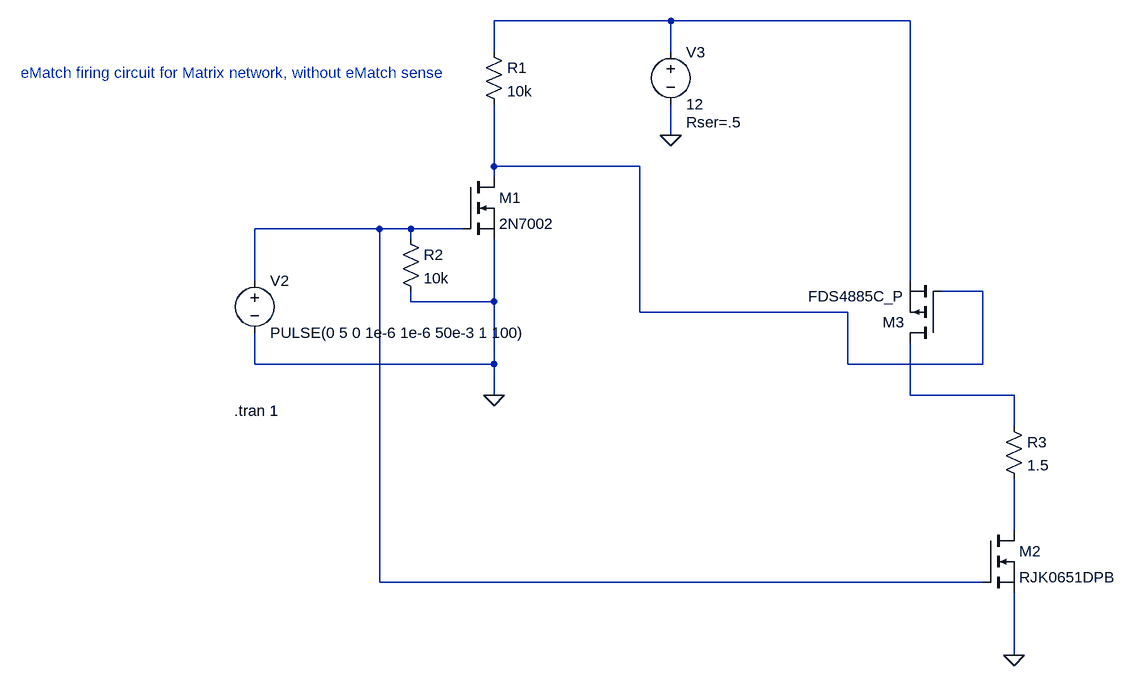
[diagram p0: schematic MatrixFire.asc]
MatrixFire.asc, the LTspice schematic file:
Version 4
SHEET 1 1420 900
WIRE 432 -96 160 -96
WIRE 800 -96 432 -96
WIRE 160 -48 160 -96
WIRE 432 -48 432 -96
WIRE 432 80 432 32
WIRE 160 128 160 32
WIRE 384 128 160 128
WIRE 160 144 160 128
WIRE -16 224 -208 224
WIRE 32 224 -16 224
WIRE 112 224 32 224
WIRE 32 240 32 224
WIRE -208 304 -208 224
WIRE 800 304 800 -96
WIRE 912 320 848 320
WIRE 32 336 32 320
WIRE 160 336 160 240
WIRE 160 336 32 336
WIRE 384 352 384 128
WIRE 704 352 384 352
WIRE -208 432 -208 384
WIRE 160 432 160 336
WIRE 160 432 -208 432
WIRE 704 432 704 352
WIRE 912 432 912 320
WIRE 912 432 704 432
WIRE 160 480 160 432
WIRE 800 480 800 400
WIRE 960 480 800 480
WIRE 960 528 960 480
WIRE 960 688 960 608
WIRE -16 768 -16 224
WIRE 912 768 -16 768
WIRE 960 880 960 784
FLAG 160 480 0
FLAG 432 80 0
FLAG 960 880 0
SYMBOL nmos 112 144 R0
SYMATTR InstName M1
SYMATTR Value 2N7002
SYMBOL res 144 -64 R0
SYMATTR InstName R1
SYMATTR Value 10k
SYMBOL res 16 224 R0
SYMATTR InstName R2
SYMATTR Value 10k
SYMBOL voltage -208 288 R0
WINDOW 123 0 0 Left 2
WINDOW 39 0 0 Left 2
SYMATTR InstName V2
SYMATTR Value PULSE(0 5 0 1e-6 1e-6 50e-3 1 100)
SYMBOL voltage 432 -64 R0
WINDOW 123 0 0 Left 2
WINDOW 39 24 124 Left 2
SYMATTR SpiceLine Rser=.5
SYMATTR InstName V3
SYMATTR Value 12
SYMBOL res 944 512 R0
SYMATTR InstName R3
SYMATTR Value 1.5
SYMBOL pmos 848 400 R180
SYMATTR InstName M3
SYMATTR Value FDS4885C_P
SYMBOL nmos 912 688 R0
SYMATTR InstName M2
SYMATTR Value RJK0651DPB
TEXT -240 504 Left 2 !.tran 1
TEXT -568 -16 Left 2 ;eMatch firing circuit for Matrix network, without eMatch sense

The netlist it stands for:
* MatrixFire.asc
M1 N002 N003 0 0 2N7002
R1 N001 N002 10k
R2 N003 0 10k
V2 N003 0 PULSE(0 5 0 1e-6 1e-6 50e-3 1 100)
V3 N001 0 12 Rser=.5
R3 N004 N005 1.5
M3 N004 N002 N001 N001 FDS4885C_P
M2 N005 N003 0 0 RJK0651DPB
.model NMOS NMOS
.model PMOS PMOS
.lib standard.mos
.tran 1
* eMatch firing circuit for Matrix network, without eMatch sense
.backanno
.end